# EAGLE design tps63001module (EAGLE 7.4.0)
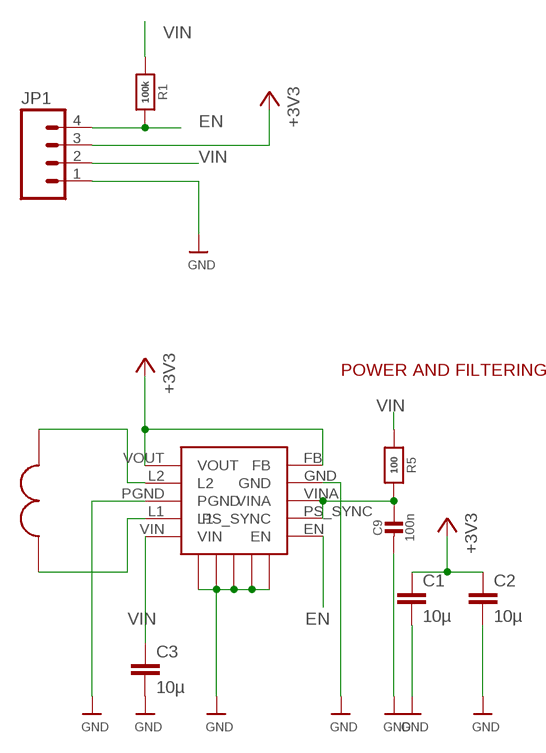
[diagram p0: schematic, sheet 1]

## Parts
C1  10µ  C-EUC0805  [C0805]
C2  10µ  C-EUC0805  [C0805]
C3  10µ  C-EUC0805  [C0805]
C9  100n  CAP_CERAMIC0603_NO  [0603-NO]
JP1  M04PTH  [1X04]
R1  100k  RESISTOR_0603_NOOUT  [0603-NO]
R5  100  RESISTOR_0603_NOOUT  [0603-NO]
U$12  TPS63001  [TPS63001]
U$15  VLF4012A  [VLF4012A]

## Nets
+3V3: C1.1 C2.1 JP1.3 U$12.FB U$12.VOUT
EN: JP1.4 R1.2 U$12.EN
GND: C1.2 C2.2 C3.2 C9.2 JP1.1 U$12.GND U$12.GNDP1 U$12.GNDP2 U$12.GNDP3 U$12.GNDP4 U$12.GNDP5 U$12.PGND
N$8: U$12.L1 U$15.P$1
N$9: U$12.L2 U$15.P$2
VIN: C3.1 JP1.2 R1.1 R5.1 U$12.VIN
VINA_ETC: C9.1 R5.2 U$12.PS_SYNC U$12.VINA

## Notes on the sheet
- POWER AND FILTERING

## Library data of the parts
C1-C3 = rcl:C-EU: CAPACITOR, European symbol
C9 = microbuilder:CAP_CERAMIC: Ceramic Capacitors For new designs, use the packages preceded by an '_' character since they are more reliable: The following footprints should be used on most boards: _0402 - Standard footprint for regular board layouts _0603 - Standard footprint for regular board layouts _0805 - Standard footprint for regular board layouts _1206 - Standard footprint for regular board layouts For extremely tight-pitch boards where space is at a premium, the following 'micro-pitch' footprints can be used (smaller pads, no silkscreen outline, etc.): _0402MP - Micro-pitch footprint for very dense/compact boards _0603MP - Micro-pitch footprint for very dense/compact boards _0805MP - Micro-pitch footprint for very dense/compact boards _1206MP - Micro-pitch footprint for very dense/compact boards
JP1 = SparkFun-Connectors:M04: Header 4 Standard 4-pin 0.1" header. Use with straight break away headers (SKU : PRT-00116), right angle break away headers (PRT-00553), swiss pins (PRT-00743), machine pins (PRT-00117), and female headers (PRT-00115). Molex polarized connector foot print use with SKU : PRT-08231 with associated crimp pins and housings. 1MM SMD Version SKU: PRT-10208
R1 R5 = microbuilder:RESISTOR: Resistors For new designs, use the packages preceded by an '_' character since they are more reliable: The following footprints should be used on most boards: _0402 - Standard footprint for regular board layouts _0603 - Standard footprint for regular board layouts _0805 - Standard footprint for regular board layouts _1206 - Standard footprint for regular board layouts For extremely tight-pitch boards where space is at a premium, the following 'micro-pitch' footprints can be used (smaller pads, no silkscreen outline, etc.): _0402MP - Micro-pitch footprint for very dense/compact boards _0603MP - Micro-pitch footprint for very dense/compact boards _0805MP - Micro-pitch footprint for very dense/compact boards _1206MP - Micro-pitch footprint for very dense/compact boards
U$12 = tps63001:TPS63001
U$15 = VLF4012A:VLF4012A

## Board
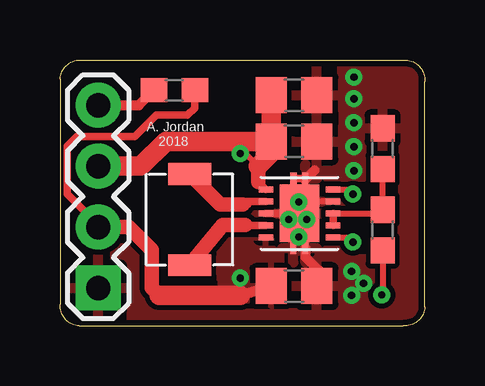
[diagram p1: board, top side]
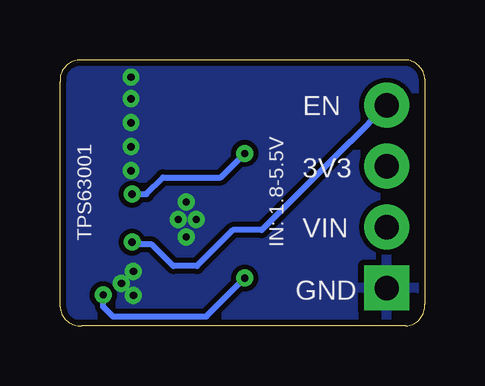
[diagram p2: board, bottom side, seen from below]

Size 15.2 x 11.1 mm. Coordinates in mm from the lower left corner, seen from the top.
Outline: 0.8,0 14.3,0 arc90 15.2,0.8 15.2,10.2 arc90 14.4,11.1 0.9,11.1 arc90 0,10.3 0,0.9 arc90 0.8,0
Copper layers (1*16): Top 0.035mm / dielectric 1.5mm / Bottom 0.035mm
Design rules "default *": minimum track width 10mil, minimum drill 24mil, track to track 8mil, track to pad 8mil, pad to pad 8mil, via to via 8mil, smd to smd 8mil, copper to edge 10mil, drill to drill 8mil, minimum pad ring 10mil, minimum via ring 8mil, stop-mask expansion 4mil, vias tented up to drill 20mil, thermal gap 10mil

### Footprints (pad centres in the part's own frame; a part is rotated, then mirrored left to right if it is on the bottom)
C0805 = smd 1.3 x 1.5: 1 -0.95,0; 2 0.95,0
0603-NO = smd 1.1 x 1: 1 -0.85,0; 2 0.85,0
1X04 = drill 1.016 pad 1.88 square: 1 0,0 | drill 1.016 pad 1.88: 2 2.54,0; 3 5.08,0; 4 7.62,0
TPS63001 = smd 0.6 x 0.24: EN 2.8,-2; FB 2.8,0; GND 2.8,-0.5; L1 0,-1.5; L2 0,-0.5; PGND 0,-1; PS_SYNC 2.8,-1.5; VIN 0,-2; VINA 2.8,-1; VOUT 0,0 | smd 1.65 x 2.4: GNDP1 1.4,-1 | smd 0.25 x 0.5: GNDP2 1.15,-2.45; GNDP3 1.65,-2.45; GNDP4 1.16,0.45; GNDP5 1.65,0.45; P$16 1.15,0.45
VLF4012A = smd 0.9 x 1.8: P$1 0,0; P$2 3.8,0

### Placement (x,y rotation side)
C1  9.74,9.63 0 top
C2  9.74,7.7 0 top
C3  9.74,1.67 0 top
C9  13.44,7.4 90 top
JP1  1.59,1.59 90 top
R1  4.76,9.84 180 top
R5  13.44,4.01 90 top
U$12  8.57,5.7 0 top
U$15  5.4,2.54 90 top

### Tracks (layer width: path | path; a pad name or v marks a point on that pad's centre or on a via)
+3V3  (via drill 0.3)
  Top 0.254: U$12.FB 12.2,5.7 v12.2,5.5 | v7.5,7.2 7.72,7.2 8.26,6.67
  Top 0.305: 8.26,6.02 U$12.VOUT
  Top 0.61: 8.26,6.67 8.26,6.02 | C2.1
  Top 0.813: 8.58,9.84 C1.1 C2.1 8.89,7.3 8.26,6.67 | JP1.3 3.37,6.67 4.4,7.7 C2.1
  Bottom 0.254: v12.2,5.5 11.6,5.5 10.9,6.2 8.5,6.2 v7.5,7.2
EN  (via drill 0.3)
  Top 0.254: U$12.EN 12.2,3.7 v12.2,3.5
  Top 0.406: JP1.4 3.28,9.21 R1.2
  Bottom 0.254: JP1.4 3.1,7.7 6.8,4 8,4 9.5,2.5 10.48,2.5 11.37,3.4 12.1,3.4 v12.2,3.5
GND  (via drill 0.3)
  Top 0.254: U$12.GND 10.03,5.2 v9.94,5.18 9.73,5.19 U$12.GNDP4
  Top 0.305: U$12.PGND 9.68,4.7 v9.53,4.45 | U$12.GNDP3 10.22,3.43 v9.94,3.71 | U$12.GNDP4 U$12.GNDP5
  Top 0.406: U$12.GNDP3 10.22,2.88 10.8,2.3 10.8,1.28 C3.2 | 10.6,6.5 10.2,6.1 10.2,6.13 U$12.GNDP5
  other vias: 10.28,4.45 12.24,9.48 12.24,8.48 12.24,7.48 12.14,2.28 12.14,1.28 12.24,6.48 12.24,10.38 12.64,1.78
  pour Top: -0.95,11.75 -0.95,-0.95 20.32,-0.95 20.32,12.07 -0.95,12.07
  pour Bottom: -0.32,11.43 -0.32,-0.32 19.69,-0.32 19.69,11.43
N$8
  Top 0.305: 7.72,4.21 7.71,4.11 7.7,4.2 8.37,4.2 U$12.L1
  Top 0.61: U$15.P$1 6.77,4.21 7.72,4.21
N$9
  Top 0.305: 7.62,5.08 7.82,5.08 7.7,5.1 7.67,5.2 U$12.L2
  Top 0.61: U$15.P$2 6.67,5.08 7.62,5.08
VIN  (via drill 0.3)
  Top 0.254: R5.1 13.45,1.26 v13.4,1.3 | v7.5,2 7.5,1.27
  Top 0.305: 2.86,4.13 1.67,4.13 0.3,5.5 0.3,7.5 0.7,7.9 3.1,7.9 4,8.8 5.3,8.8 5.6,9.1 R1.1
  Top 0.406: 7.5,1.27 C3.1
  Top 0.61: JP1.2 2.86,4.13 3.81,3.18 3.81,1.59 4.13,1.27
  Top 0.813: 4.13,1.27 7.5,1.27
  Bottom 0.254: v7.5,2 9.1,0.4 13,0.4 13.4,0.8 v13.4,1.3
  pour Top: 6.7,1.1 6.7,2.7 7.1,3.1 7.4,3.6 8.8,3.6 8.8,2.9 9,2.7 9,0.7 8.5,1
VINA_ETC
  Top 0.254: U$12.VINA 13.38,4.7 R5.2 C9.1
  Top 0.305: U$12.PS_SYNC U$12.VINA

### Text on the board
tPlace: A. Jordan / 2018
bPlace: EN | IN: 1.8-5.5V | TPS63001 | 3V3 | VIN | GND